# Altium project HuLaMachDieuKhienPCB.PrjPCB
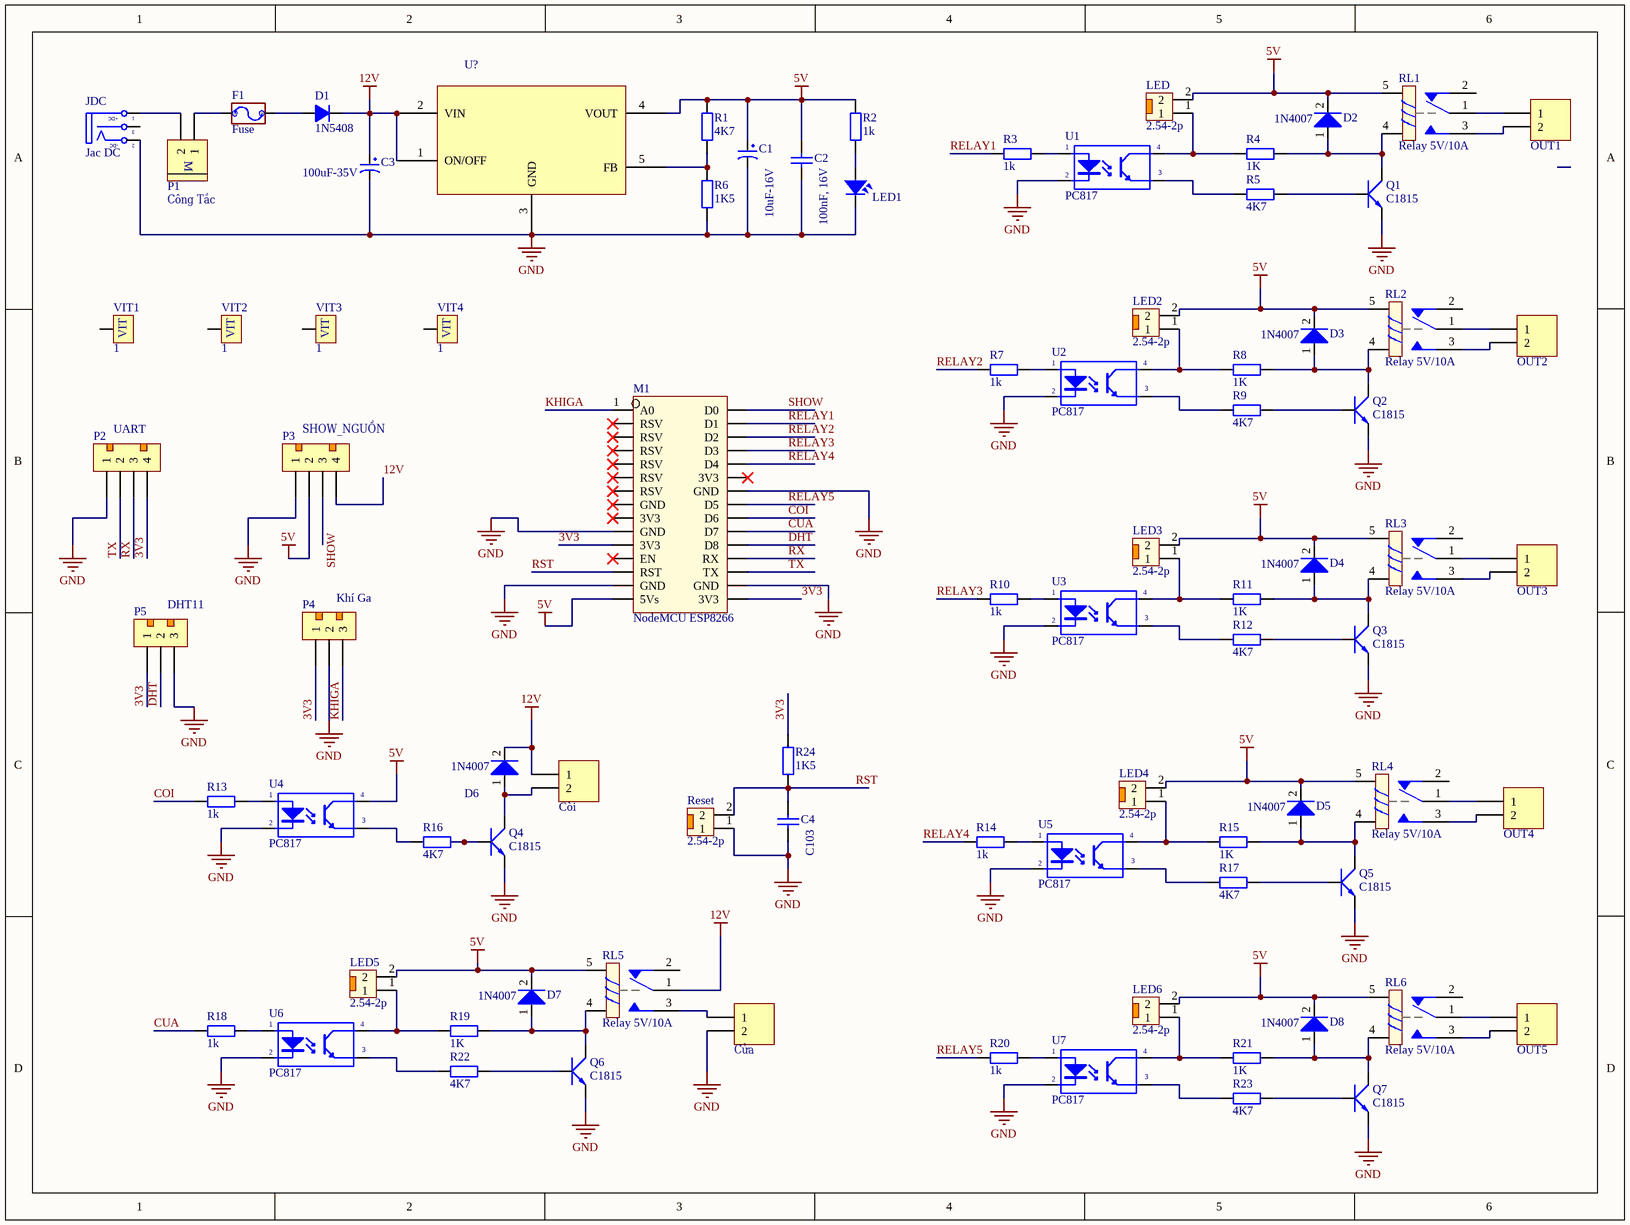
[diagram p0: HuLaMachDieuKhienSCH.SchDoc]
1 sheet, 84 parts. Net scope: global (net labels, ports and power ports of the same name join across sheets).
Board file: HuLaMachDieuKhien.PcbDoc

## Sheet HuLaMachDieuKhienSCH.SchDoc
size 304 x 228 mm

### Parts
C1  10uF-16V  [tu hoa 4mm]
C2  value 100nF, 16V  [CAPNTO2.54-3.05x1.78A]  (hidden comment: 5AK220KABAA)
C3  100uF-35V  [tu hoa 6.5mm]
C4  value C103  [CAPNTO2.54-3.05x1.78A]  (hidden comment: 5AK220KABAA)
Còi  Header 2_1  [HED2]  (value not drawn)
Cửa  Header 2_1  [HED2]  (value not drawn)
D1  1N5408  [D5A]
D2  1N4007  [1N4007]
D3  1N4007  [1N4007]
D4  1N4007  [1N4007]
D5  1N4007  [1N4007]
D6  1N4007  [1N4007]
D7  1N4007  [1N4007]
D8  1N4007  [1N4007]
F1  Fuse  [FUSE_BOX]
JDC  Jac DC  [DC-IN]
LED  2.54-2p  [Header Duc Thang 2P 2.54]
LED1  LED  [LED-3]  (value not drawn)
LED2  2.54-2p  [Header Duc Thang 2P 2.54]
LED3  2.54-2p  [Header Duc Thang 2P 2.54]
LED4  2.54-2p  [Header Duc Thang 2P 2.54]
LED5  2.54-2p  [Header Duc Thang 2P 2.54]
LED6  2.54-2p  [Header Duc Thang 2P 2.54]
M1  NodeMCU ESP8266  [NodeMCU ESP8266]
MIC1  U?  [Mic5V]
OUT1  Header 2_1  [HED2]  (value not drawn)
OUT2  Header 2_1  [HED2]  (value not drawn)
OUT3  Header 2_1  [HED2]  (value not drawn)
OUT4  Header 2_1  [HED2]  (value not drawn)
OUT5  Header 2_1  [HED2]  (value not drawn)
P1  Công Tắc  [Medium - Header 2]
P2  UART  [Header Duc Thang 4p 2.54]
P3  SHOW_NGUỒN  [Header Duc Thang 4p 2.54]
P4  Khí Ga  [Header duc thang 3p 2.54]
P5  DHT11  [Header duc thang 3p 2.54]
Q1  C1815  [QTO-92]
Q2  C1815  [QTO-92]
Q3  C1815  [QTO-92]
Q4  C1815  [QTO-92]
Q5  C1815  [QTO-92]
Q6  C1815  [QTO-92]
Q7  C1815  [QTO-92]
R1  4K7  [R1/4W]
R2  1k  [R1/4W]
R3  1k  [R1/4W]
R4  1K  [R1/4W]
R5  4K7  [R1/4W]
R6  1K5  [R1/4W]
R7  1k  [R1/4W]
R8  1K  [R1/4W]
R9  4K7  [R1/4W]
R10  1k  [R1/4W]
R11  1K  [R1/4W]
R12  4K7  [R1/4W]
R13  1k  [R1/4W]
R14  1k  [R1/4W]
R15  1K  [R1/4W]
R16  4K7  [R1/4W]
R17  4K7  [R1/4W]
R18  1k  [R1/4W]
R19  1K  [R1/4W]
R20  1k  [R1/4W]
R21  1K  [R1/4W]
R22  4K7  [R1/4W]
R23  4K7  [R1/4W]
R24  1K5  [R1/4W]
Reset  2.54-2p  [Header Duc Thang 2P 2.54]
RL1  Relay 5V/10A  [RL_10A_5V]
RL2  Relay 5V/10A  [RL_10A_5V]
RL3  Relay 5V/10A  [RL_10A_5V]
RL4  Relay 5V/10A  [RL_10A_5V]
RL5  Relay 5V/10A  [RL_10A_5V]
RL6  Relay 5V/10A  [RL_10A_5V]
U1  PC817  [DIP4/W0.3]
U2  PC817  [DIP4/W0.3]
U3  PC817  [DIP4/W0.3]
U4  PC817  [DIP4/W0.3]
U5  PC817  [DIP4/W0.3]
U6  PC817  [DIP4/W0.3]
U7  PC817  [DIP4/W0.3]
VIT1  1  [VIT]
VIT2  1  [VIT]
VIT3  1  [VIT]
VIT4  1  [VIT]

### Nets
5V: C1.1 C2.1 D2.2(K) D3.2(K) D4.2(K) D5.2(K) D7.2(K) D8.2(K) LED.2 LED2.2 LED3.2 LED4.2 LED5.2 LED6.2 M1.15(5Vs) MIC1.4(VOUT) P3.2 R1.2 R2.2 RL1.5 RL2.5 RL3.5 RL4.5 RL5.5 RL6.5 U4.4(C)
12V: C3.1 Còi.1 D1.2(K) D6.2(K) MIC1.1(ON/OFF) MIC1.2(VIN) P3.4 RL5.1
GND: C1.2 C2.2 C3.2 C4.2 Cửa.2 JDC.2(TN) LED1.2 M1.10(GND) M1.14(GND) M1.17(GND) M1.24(GND) MIC1.3(GND) P2.1 P3.1 P4.2 P5.3 Q1.1(E) Q2.1(E) Q3.1(E) Q4.1(E) Q5.1(E) Q6.1(E) Q7.1(E) R6.1 Reset.1 U1.2(K) U2.2(K) U3.2(K) U4.2(K) U5.2(K) U6.2(K) U7.2(K)
3V3: M1.11(3V3) M1.16(3V3) P2.4 P4.1 P5.1 R24.2
COI: M1.22(D6) R13.1
CUA: M1.21(D7) R18.1
DHT: M1.20(D8) P5.2
KHIGA: M1.1(A0) P4.3
RELAY1: M1.29(D1) R3.1
RELAY2: M1.28(D2) R7.1
RELAY3: M1.27(D3) R10.1
RELAY4: M1.26(D4) R14.1
RELAY5: M1.23(D5) R20.1
RST: C4.1 M1.13(RST) R24.1 Reset.2
RX: M1.19(RX) P2.3
SHOW: M1.30(D0) P3.3
TX: M1.18(TX) P2.2
NetCòi_2: Còi.2 D6.1(A) Q4.2(C)
NetCửa_1: Cửa.1 RL5.3
NetD1_1: D1.1(A) F1.2
NetD2_1: D2.1(A) Q1.2(C) R4.2 RL1.4
NetD3_1: D3.1(A) Q2.2(C) R8.2 RL2.4
NetD4_1: D4.1(A) Q3.2(C) R11.2 RL3.4
NetD5_1: D5.1(A) Q5.2(C) R15.2 RL4.4
NetD7_1: D7.1(A) Q6.2(C) R19.2 RL5.4
NetD8_1: D8.1(A) Q7.2(C) R21.2 RL6.4
NetF1_1: F1.1 P1.1
NetJDC_1: JDC.1(T) P1.2
NetLED1_1: LED1.1 R2.1
NetLED2_1: LED2.1 R8.1 U2.4(C)
NetLED3_1: LED3.1 R11.1 U3.4(C)
NetLED4_1: LED4.1 R15.1 U5.4(C)
NetLED5_1: LED5.1 R19.1 U6.4(C)
NetLED6_1: LED6.1 R21.1 U7.4(C)
NetLED_1: LED.1 R4.1 U1.4(C)
NetMIC1_5: MIC1.5(FB) R1.1 R6.2
NetOUT1_1: OUT1.1 RL1.1
NetOUT1_2: OUT1.2 RL1.3
NetOUT2_1: OUT2.1 RL2.1
NetOUT2_2: OUT2.2 RL2.3
NetOUT3_1: OUT3.1 RL3.1
NetOUT3_2: OUT3.2 RL3.3
NetOUT4_1: OUT4.1 RL4.1
NetOUT4_2: OUT4.2 RL4.3
NetOUT5_1: OUT5.1 RL6.1
NetOUT5_2: OUT5.2 RL6.3
NetQ1_3: Q1.3(B) R5.2
NetQ2_3: Q2.3(B) R9.2
NetQ3_3: Q3.3(B) R12.2
NetQ4_3: Q4.3(B) R16.2
NetQ5_3: Q5.3(B) R17.2
NetQ6_3: Q6.3(B) R22.2
NetQ7_3: Q7.3(B) R23.2
NetR3_2: R3.2 U1.1(A)
NetR5_1: R5.1 U1.3(E)
NetR7_2: R7.2 U2.1(A)
NetR9_1: R9.1 U2.3(E)
NetR10_2: R10.2 U3.1(A)
NetR12_1: R12.1 U3.3(E)
NetR13_2: R13.2 U4.1(A)
NetR14_2: R14.2 U5.1(A)
NetR16_1: R16.1 U4.3(E)
NetR17_1: R17.1 U5.3(E)
NetR18_2: R18.2 U6.1(A)
NetR20_2: R20.2 U7.1(A)
NetR22_1: R22.1 U6.3(E)
NetR23_1: R23.1 U7.3(E)

Not connected (* = marked no-connect by the designer): JDC 3(S); M1 2(RSV)* 3(RSV)* 4(RSV)* 5(RSV)* 6(RSV)* 7(RSV)* 8(GND)* 9(3V3)* 12(EN)* 25(3V3)*; RL1 2; RL2 2; RL3 2; RL4 2; RL5 2; RL6 2; VIT1 VIT1(1); VIT2 VIT1(1); VIT3 VIT1(1); VIT4 VIT1(1)

### Notes on the sheet
- (in symbol DCIN) +DC; -DC
- (in symbol Header 2 - M) M

### Library data of the parts
C1 = Tu Hoa 10uF 16V 4x7: Cắm; So_Chan: 2; Don_Vi: Con; Ten_Linh_Kien: Tụ Hóa 10uF 16V; Ma_Hang: MH006855; Chung_Loai: Cắm; Kieu_Chan: *
C2 C4 = 5AK220KABAA: CAP NPO CAPNTO 22pF 100V 10%; ComponentLink1Description: Datasheet; ComponentLink1URL: D:\Dropbox\Datasheets\Passive Components\Capacitors\AVX Disc Ceramic Capacitors.pdf; Unit Price: 0.003
C3 = Tu Hoa 100uF 35V 6x8: Cắm; Don_Vi: Con; So_Chan: 2; Ten_Linh_Kien: Tụ Hóa 100uF 35V; Ma_Hang: MH006862; Chung_Loai: Cắm; Kieu_Chan: *
Còi Cửa OUT1-OUT5 = Header 2_1: Header, 2-Pin; Manufacturer: Generic Components; Class: Connector; Value: Header 2
D1 = D5A: Diode 5A; Value: 1N5408
D2-D8 = 1N4007: Diode LS 1A 1000V DO-41; ComponentLink1Description: Datasheet; ComponentLink1URL: D:\Dropbox\Datasheets\Diodes and Rectifiers\Diodes\1N400X.pdf; Unit Price: 0.0072
JDC = DCIN: Jac DC input; Value: Jac DC
LED LED2-LED6 Reset = Header 2.54-2p Duc Thang: Cắm; So_Chan: 2; Don_Vi: Con; Ten_Linh_Kien: Header 2P XH2.54-2P Đực Thẳng; Ma_Hang: MH001283; Chung_Loai: Cắm; Kieu_Chan: *
LED1 = LED: LED Single colour Green and Red; Value: LED 3 ly Single Colour
MIC1 = Mic5V: 3A
P1 = Header 2 - M: Header, 2-Pin, Medium; LatestRevisionDate: 17-Jul-2002; LatestRevisionNote: Re-released for DXP Platform.; Publisher: Altium Limited
P2 P3 = Header 2.54_4p Duc Thang: Cắm; Don_Vi: Con; So_Chan: 4; Ten_Linh_Kien: Header 4P XH2.54-4P Đực Thẳng; Ma_Hang: MH001285; Chung_Loai: Cắm; Kieu_Chan: *
P4 P5 = Header 2.54_3p Duc Thang: Cắm; Don_Vi: Con; Ten_Linh_Kien: Header 3P XH2.54-3P Đực Thẳng; Ma_Hang: MH001292; Chung_Loai: Cắm
Q1-Q7 = C1815: NPN 600mW, ECB; Value: C1815
R1-R24 = R1/4W: Resistor 1/4W; Value: R1/4W - 1K
RL1-RL6 = Relay 5V10A: Relay SPDT,10A - 12VDC 5 Pin; Value: Relay SPDT, 10A, 12V
U1-U7 = PC817: Single Opto; Value: PC817
VIT1-VIT4 = VIT: Oc Vit